# EAGLE design atmega32u4bb (EAGLE 9.5.2)
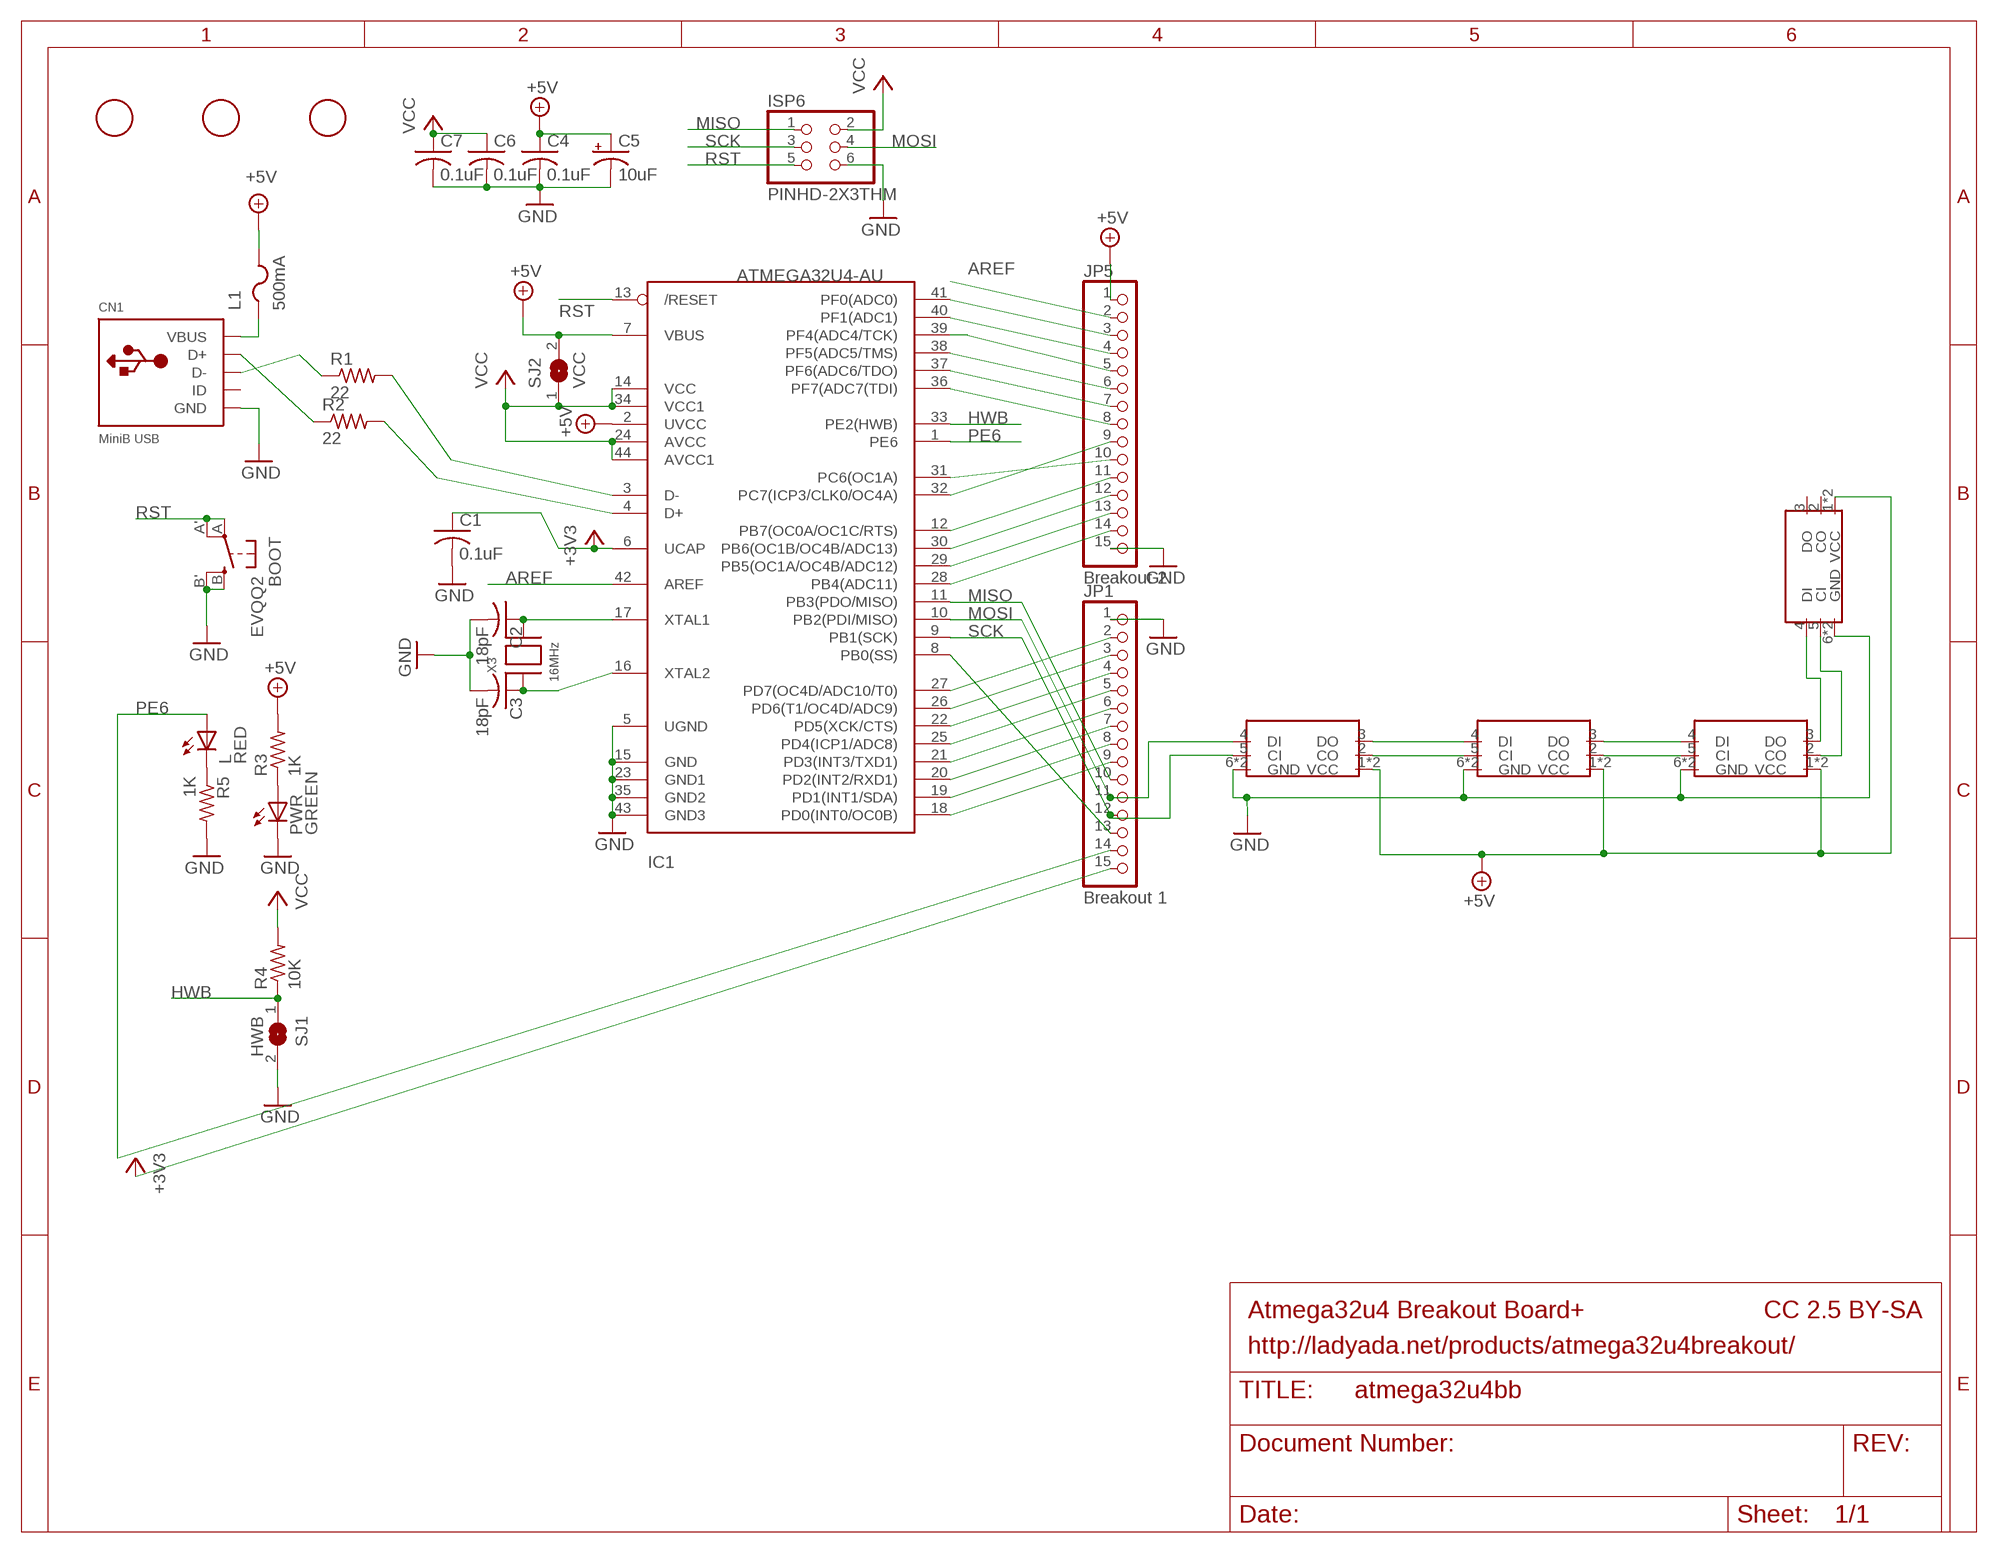
[diagram p0: schematic, sheet 1]

## Parts
BOOT  EVQQ2  [EVQ-Q2]
C1  0.1uF  C-USC0805K  [C0805K]
C2  18pF  C-USC0805K  [C0805K]
C3  18pF  C-USC0805K  [C0805K]
C4  0.1uF  C-USC0805K  [C0805K]
C5  10uF  CPOL-USA/3216-18R  [A/3216-18R]
C6  0.1uF  C-USC0805K  [C0805K]
C7  0.1uF  C-USC0805K  [C0805K]
CN1  MiniB USB  USBMINIB  [USB-MINIB]
IC1  ATMEGA32U4-AU  [TQFP44]
ISP6  PINHD-2X3THM  [ISP6]
JP1  Breakout 1  PINHD-1X15-CB  [1X15-CB]
JP5  Breakout 2  PINHD-1X15-CB  [1X15-CB]
L  RED  LEDCHIPLED_0805  [CHIPLED_0805]
L1  500mA  PTCFUSE-1206  [R1206]
PWR  GREEN  LEDCHIPLED_0805  [CHIPLED_0805]
R1  22  R-US_R0805  [R0805]
R2  22  R-US_R0805  [R0805]
R3  1K  R-US_R0805  [R0805]
R4  10K  R-US_R0805  [R0805]
R5  1K  R-US_R0805  [R0805]
SJ1  HWB  SJ  [SJ]
SJ2  VCC  SJ  [SJ]
U$1  FIDUCIAL  [FIDUCIAL_1MM]
U$2  FIDUCIAL  [FIDUCIAL_1MM]
U$3  DOTSTAR2020  [LED_3341]
U$5  DOTSTAR2020  [LED_3341]
U$6  FIDUCIAL  [FIDUCIAL_1MM]
U$7  DOTSTAR2020  [LED_3341]
U$8  DOTSTAR2020  [LED_3341]
X3  16MHz  XTALNX5032  [NX5032]

## Nets
+3V3: C1.1 IC1.6(UCAP) JP1.15
+5V: C4.1 C5.+ IC1.2(UVCC) IC1.7(VBUS) JP5.1 L1.2 R3.2 SJ2.2 U$3.1(VCC) U$3.8(VCC) U$5.1(VCC) U$5.8(VCC) U$7.1(VCC) U$7.8(VCC) U$8.1(VCC) U$8.8(VCC)
AREF: IC1.42(AREF) JP5.2
GND: BOOT.B'(S1) BOOT.B(S) C1.2 C2.2 C3.2 C4.2 C5.- C6.2 C7.2 CN1.GND IC1.5(UGND) IC1.15(GND) IC1.23(GND1) IC1.35(GND2) IC1.43(GND3) ISP6.6 JP1.1 JP5.15 PWR.C R5.2 SJ1.2 U$3.6(GND) U$3.7(GND) U$5.6(GND) U$5.7(GND) U$7.6(GND) U$7.7(GND) U$8.6(GND) U$8.7(GND)
HWB: IC1.33(PE2(HWB)) R4.1 SJ1.1
MISO: IC1.11(PB3(PDO/MISO)) ISP6.1 JP1.10
MOSI: IC1.10(PB2(PDI/MISO)) ISP6.4 JP1.11 U$3.4(DI)
N$1: PWR.A R3.1
N$2: CN1.D+ R2.1
N$3: IC1.3(D-) R1.2
N$4: IC1.4(D+) R2.2
N$5: CN1.D- R1.1
N$8: C2.1 IC1.17(XTAL1) X3.P$2
N$9: C3.1 IC1.16(XTAL2) X3.P$1
N$10: L.C R5.1
N$11: U$3.3(DO) U$5.4(DI)
N$12: U$3.2(CO) U$5.5(CI)
N$13: U$5.3(DO) U$7.4(DI)
N$14: U$5.2(CO) U$7.5(CI)
N$15: U$7.3(DO) U$8.4(DI)
N$16: U$7.2(CO) U$8.5(CI)
PB0: IC1.8(PB0(SS)) JP1.13
PB4: IC1.28(PB4(ADC11)) JP5.14
PB5: IC1.29(PB5(OC1A/OC4B/ADC12)) JP5.13
PB6: IC1.30(PB6(OC1B/OC4B/ADC13)) JP5.12
PB7: IC1.12(PB7(OC0A/OC1C/RTS)) JP5.11
PC6: IC1.31(PC6(OC1A)) JP5.10
PC7: IC1.32(PC7(ICP3/CLK0/OC4A)) JP5.9
PD0: IC1.18(PD0(INT0/OC0B)) JP1.9
PD1: IC1.19(PD1(INT1/SDA)) JP1.8
PD2: IC1.20(PD2(INT2/RXD1)) JP1.7
PD3: IC1.21(PD3(INT3/TXD1)) JP1.6
PD4: IC1.25(PD4(ICP1/ADC8)) JP1.5
PD5: IC1.22(PD5(XCK/CTS)) JP1.4
PD6: IC1.26(PD6(T1/OC4D/ADC9)) JP1.3
PD7: IC1.27(PD7(OC4D/ADC10/T0)) JP1.2
PE6: IC1.1(PE6) JP1.14 L.A
PF0: IC1.41(PF0(ADC0)) JP5.3
PF1: IC1.40(PF1(ADC1)) JP5.4
PF4: IC1.39(PF4(ADC4/TCK)) JP5.5
PF5: IC1.38(PF5(ADC5/TMS)) JP5.6
PF6: IC1.37(PF6(ADC6/TDO)) JP5.7
PF7: IC1.36(PF7(ADC7(TDI)) JP5.8
RST: BOOT.A'(P1) BOOT.A(P) IC1.13(/RESET) ISP6.5
SCK: IC1.9(PB1(SCK)) ISP6.3 JP1.12 U$3.5(CI)
VBUS: CN1.VBUS L1.1
VCC: C6.1 C7.1 IC1.14(VCC) IC1.24(AVCC) IC1.34(VCC1) IC1.44(AVCC1) ISP6.2 R4.2 SJ2.1
Unconnected: CN1.ID U$8.2(CO) U$8.3(DO)

## Notes on the sheet
- Atmega32u4 Breakout Board+ | CC 2.5 BY-SA
- http://ladyada.net/products/atmega32u4breakout/

## Library data of the parts
BOOT = adaprog:EVQQ2
C1-C4 C6 C7 = adafruit:C-US: CAPACITOR, American symbol
C5 = adafruit:CPOL-US: POLARIZED CAPACITOR, American symbol
CN1 = adafruit:USB: USB Connectors USBMINIB - Surface Mount Female Mini-B USB Connector 4UConnector: 06564 By microbuilder.eu Thru-hole RA Female Mini-B USB Connector 4UConnector: 18732 By ladyada.net
IC1 = adaprog:ATMEGA32U4
ISP6 = adaprog:PINHD-2X3
JP1 JP5 = adafruit:PINHD-1X15: PIN HEADER
L PWR = adafruit:LED: LED OSRAM: - CHIPLED LG R971, LG N971, LY N971, LG Q971, LY Q971, LO R971, LY R971 LH N974, LH R974 LS Q976, LO Q976, LY Q976 LO Q996 - Hyper CHIPLED LW Q18S LB Q993, LB Q99A, LB R99A - SideLED LS A670, LO A670, LY A670, LG A670, LP A670 LB A673, LV A673, LT A673, LW A673 LH A674 LY A675 LS A676, LA A676, LO A676, LY A676, LW A676 LS A679, LY A679, LG A679 - Hyper Micro SIDELED® LS Y876, LA Y876, LO Y876, LY Y876 LT Y87S - SmartLED LW L88C, LW L88S LB L89C, LB L89S, LG L890 LS L89K, LO L89K, LY L89K LS L896, LA L896, LO L896, LY L896 - TOPLED LS T670, LO T670, LY T670, LG T670, LP T670 LSG T670, LSP T670, LSY T670, LOP T670, LYG T670 LG T671, LOG T671, LSG T671 LB T673, LV T673, LT T673, LW T673 LH T674 LS T676, LA T676, LO T676, LY T676, LB T676, LH T676, LSB T676, LW T676 LB T67C, LV T67C, LT T67C, LS T67K, LO T67K, LY T67K, LW E67C LS E67B, LA E67B, LO E67B, LY E67B, LB E67C, LV E67C, LT E67C LW T67C LS T679, LY T679, LG T679 LS T770, LO T770, LY T770, LG T770, LP T770 LB T773, LV T773, LT T773, LW T773 LH T774 LS E675, LA E675, LY E675, LS T675 LS T776, LA T776, LO T776, LY T776, LB T776 LHGB T686 LT T68C, LB T68C - Hyper Mini TOPLED® LB M676 - Mini TOPLED Santana® LG M470 LS M47K, LO M47K, LY M47K Source: http://www.osram.convergy.de/
L1 = adafruit:PTCFUSE: PTC fuses, resettable thermistors
R1-R5 = adafruit:R-US_: RESISTOR, American symbol
SJ1 SJ2 = jumper:SJ: SMD solder JUMPER
U$1 U$2 U$6 = adafruit:FIDUCIAL: For use by pick and place machines to calibrate the vision/machine, 1mm By microbuilder.eu
U$3 U$5 U$7 U$8 = codenext2020:DOTSTAR
X3 = adaprog:XTAL

## Board
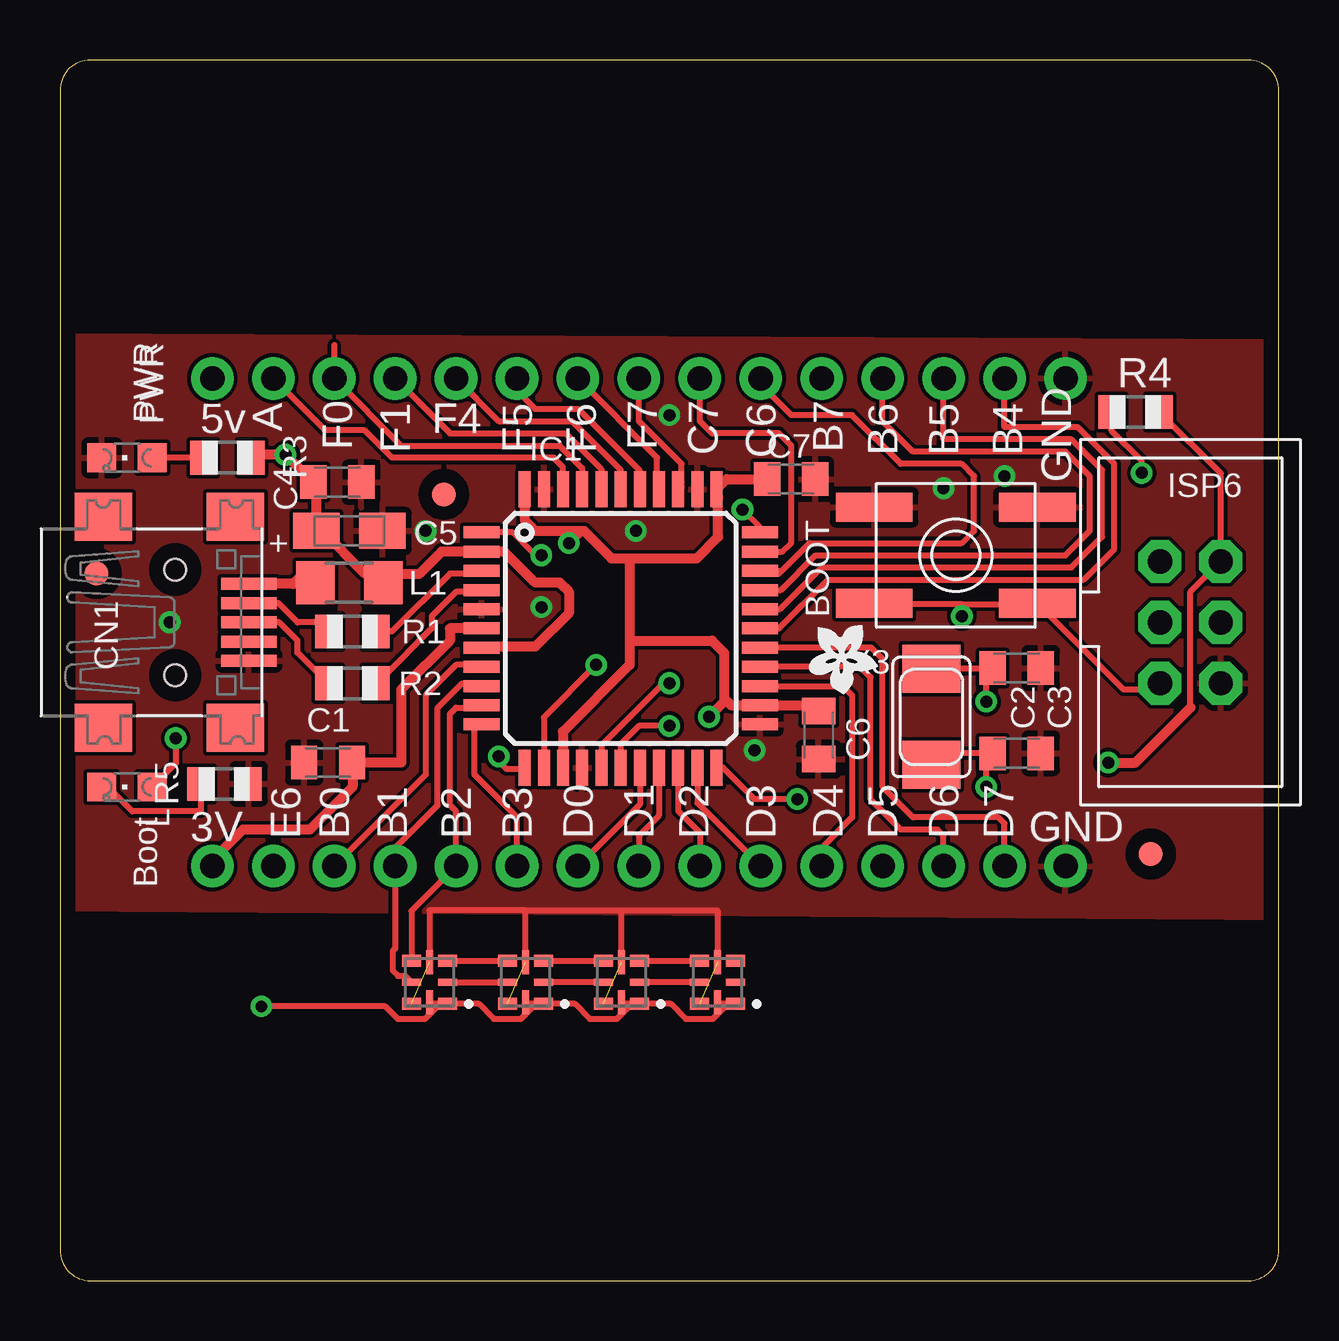
[diagram p1: board, top side]
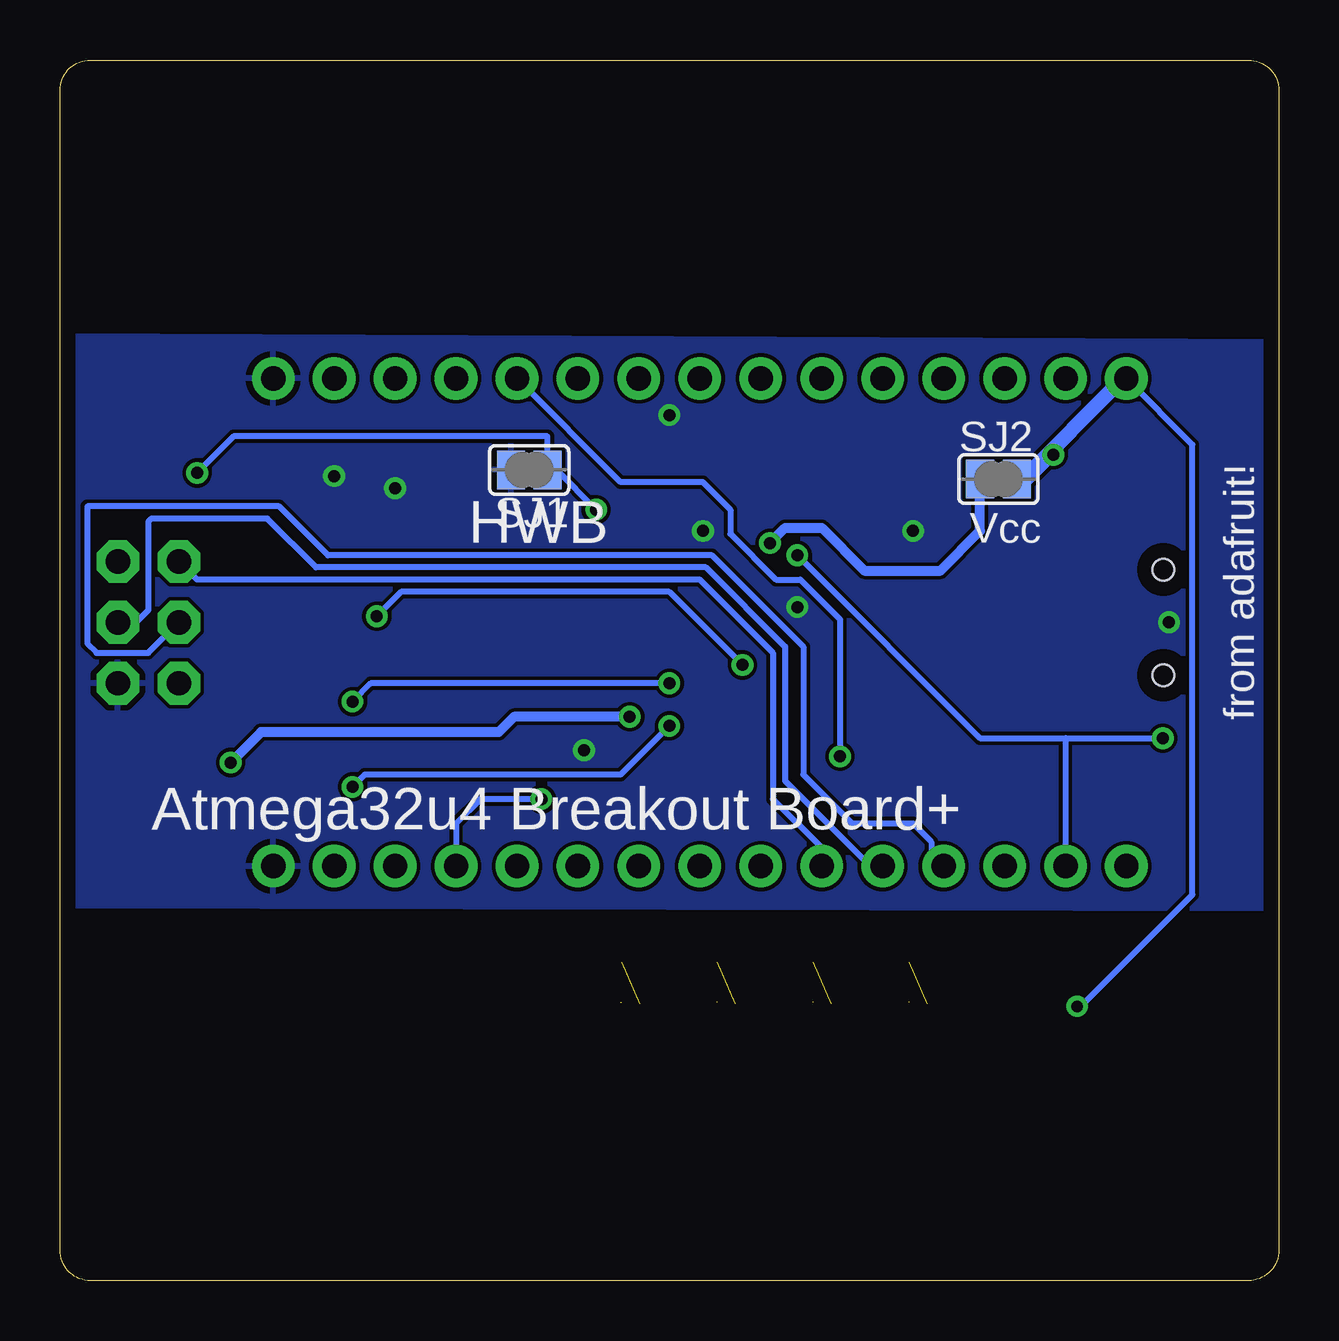
[diagram p2: board, bottom side, seen from below]

Size 50.8 x 50.86 mm. Coordinates in mm from the lower left corner, seen from the top.
Outline: 1.27,50.86 arc90 0,49.59 0,1.27 arc90 1.27,0 49.53,0 arc90 50.8,1.27 50.8,49.59 arc90 49.53,50.86 1.27,50.86
Copper layers (1*16): Top 0.035mm / dielectric 1.5mm / Bottom 0.035mm
Design rules "default *": minimum track width 10mil, minimum drill 19mil, track to track 6mil, track to pad 6mil, pad to pad 6mil, via to via 6mil, smd to smd 0mil, copper to edge 25mil, drill to drill 8mil, minimum pad ring 10mil, minimum via ring 8mil, stop-mask expansion 4mil, vias tented up to drill 20mil, thermal gap 10mil

### Footprints (pad centres in the part's own frame; a part is rotated, then mirrored left to right if it is on the bottom)
EVQ-Q2 = smd 3.2 x 1.2: A -3.4,-2; A' 3.4,-2; B -3.4,2; B' 3.4,2
C0805K = smd 1.1 x 1.4: 1 -1,0; 2 1,0
A/3216-18R = smd 1.95 x 1.5: + 1.375,0; - -1.375,0
USB-MINIB = smd 0.5 x 2.308: D+ 0,4.064; D- -0.8,4.064; GND 1.6,4.064; ID 0.8,4.064; VBUS -1.6,4.064 | smd 2 x 2.4: GND1 -4.4,-2; GND2 -4.4,3.5; GND3 4.4,3.5; GND4 4.4,-2 | hole 0.9: -2.2,1; 2.2,1
TQFP44 = smd 1.5 x 0.5: 1 -5.8,4; 2 -5.8,3.2; 3 -5.8,2.4; 4 -5.8,1.6; 5 -5.8,0.8; 6 -5.8,0; 7 -5.8,-0.8; 8 -5.8,-1.6; 9 -5.8,-2.4; 10 -5.8,-3.2; 11 -5.8,-4; 23 5.8,-4; 24 5.8,-3.2; 25 5.8,-2.4; 26 5.8,-1.6; 27 5.8,-0.8; 28 5.8,0; 29 5.8,0.8; 30 5.8,1.6; 31 5.8,2.4; 32 5.8,3.2; 33 5.8,4 | smd 0.5 x 1.5: 12 -4,-5.8; 13 -3.2,-5.8; 14 -2.4,-5.8; 15 -1.6,-5.8; 16 -0.8,-5.8; 17 0,-5.8; 18 0.8,-5.8; 19 1.6,-5.8; 20 2.4,-5.8; 21 3.2,-5.8; 22 4,-5.8; 34 4,5.8; 35 3.2,5.8; 36 2.4,5.8; 37 1.6,5.8; 38 0.8,5.8; 39 0,5.8; 40 -0.8,5.8; 41 -1.6,5.8; 42 -2.4,5.8; 43 -3.2,5.8; 44 -4,5.8
ISP6 = drill 1.016 pad 1.778 octagon: 1 -2.54,-1.27; 2 -2.54,1.27; 3 0,-1.27; 4 0,1.27; 5 2.54,-1.27; 6 2.54,1.27
1X15-CB = drill 1.016 pad 1.778: 1 -17.78,0; 2 -15.24,0; 3 -12.7,0; 4 -10.16,0; 5 -7.62,0; 6 -5.08,0; 7 -2.54,0; 8 0,0; 9 2.54,0; 10 5.08,0; 11 7.62,0; 12 10.16,0; 13 12.7,0; 14 15.24,0; 15 17.78,0
CHIPLED_0805 = smd 1.2 x 1.2: A 0,-1.05; C 0,1.05
R1206 = smd 1.6 x 1.803: 1 -1.422,0; 2 1.422,0
R0805 = smd 1.1 x 1.4: 1 -1,0; 2 1,0
SJ = smd 1.168 x 1.6: 1 -0.762,0; 2 0.762,0
FIDUCIAL_1MM = smd 1 x 1: 1 0,0
LED_3341 = smd 0.8 x 0.5: 1 -0.75,0.9; 3 -0.75,-0.9; 4 0.75,-0.9; 6 0.75,0.9 | smd 0.8 x 0.3: 2 -0.75,0; 5 0.75,0 | smd 0.3 x 1: 7 0,-0.83; 8 0,0.83
NX5032 = smd 2 x 2.4: P$1 2,0; P$2 -2,0

### Placement (x,y rotation side)
BOOT  37.34,30.22 0 top
C1  11.18,21.59 180 top
C2  39.88,21.97 0 top
C3  39.88,25.52 0 top
C4  11.56,33.27 0 top
C5  12.06,31.24 180 top
C6  31.62,22.73 270 top
C7  30.48,33.4 0 top
CN1  3.81,27.43 270 top
IC1  23.37,27.18 0 top
ISP6  47.12,27.43 270 top
JP1  24.13,17.27 180 top
JP5  24.13,37.59 0 top
L  2.79,20.57 90 top
L1  12.06,29.08 0 top
PWR  2.79,34.29 90 top
R1  12.19,27.05 0 top
R2  12.19,24.89 0 top
R3  6.99,34.29 0 top
R4  44.83,36.19 0 top
R5  6.86,20.7 0 top
SJ1  31.24,33.78 180 bottom
SJ2  11.68,33.4 0 bottom
U$1  45.47,17.78 0 top
U$2  1.52,29.46 0 top
U$3  15.4,12.43 180 top
U$4  [ADAFRUIT200MIL]  32.77,25.91 180 top
U$5  19.4,12.43 180 top
U$6  16,32.76 0 top
U$7  23.4,12.43 180 top
U$8  27.4,12.43 180 top
X3  36.32,23.49 90 top

### Tracks (layer width: path | path; a pad name or v marks a point on that pad's centre or on a via)
+3V3
  Top 0.254: 12.19,21.6 12.19,21.84 | 12.19,21.6 C1.1 12.19,21.59 12.19,21.6
  Top 0.406: IC1.6 16.26,27.18 16.26,26.67 14.22,24.64 14.22,21.59 12.19,21.59 12.19,20.57 10.41,18.79 7.62,18.79 6.35,17.52 JP1.15
  Bottom 0.406: JP1.15 6.22,17.27 6.22,17.14
+5V  (via drill 0.48, 0.5)  (4 unrouted)
  Top 0.254: 10.92,31.24 C5.+ | 13.49,29.44 13.46,29.46 12.7,29.46 | C4.1 10.56,33.13 10.69,33 | 17.53,26.41 IC1.7 | U$7.1 25.46,11.53 26.09,10.9 27.21,10.9 27.84,11.53 U$8.1 27.5,11.53 27.43,11.6 | U$7.1 23.84,11.53 23.21,10.9 22.09,10.9 21.46,11.53 U$5.1 | U$5.1 19.84,11.53 19.21,10.9 18.09,10.9 17.46,11.53 U$3.1 | U$3.1 15.84,11.53 15.21,10.9 14.09,10.9 13.56,11.43 v8.4,11.43 | U$7.1 23.5,11.53 23.43,11.6 | U$5.1 19.5,11.53 19.43,11.6 | U$3.1 15.5,11.53 15.43,11.6
  Top 0.406: 12.7,29.46 10.92,31.24 | L1.2 13.49,29.44 14.96,29.44 15.9,30.38 IC1.2 18.52,30.38 19.81,29.08 20.83,29.08 21.21,28.7 21.21,27.81 19.81,26.41 17.53,26.41 | C5.+ 10.69,33 | 10.56,33.26 10.67,33.15 10.67,33.65 | C4.1 10.56,33.26 | 10.56,33.26 v9.4,34.41 8.13,34.41 8,34.29 R3.2
  Bottom 0.254: JP5.1 3.6,34.84 3.6,16.08 8.25,11.43 v8.4,11.43
  Bottom 0.61: JP5.1 6.48,37.59 10.79,33.27 | SJ2.2 10.92,33.27 10.79,33.27 | v9.4,34.41 9.53,34.41 10.67,33.27 10.79,33.27
AREF
  Top 0.254: IC1.42 20.97,33.89 20.57,34.29 13.84,34.29 12.7,35.43 11.05,35.43 JP5.2
GND  (via drill 0.5)  (4 unrouted)
  Top 0.254: U$3.7 15.4,15.43 19.4,15.43 | U$7.7 23.4,15.43 | U$8.7 27.4,15.43 19.4,15.43 | U$5.7 19.4,15.43
  Bottom 0.406: SJ1.2 30.86,33.78
  other vias: 20.07,28.07 4.57,27.43 15.24,31.24 24,31.24 28.96,22.1 25.4,36.07 36.83,33.02 39.37,33.53
  pour Top: -0.38,15.49 -0.51,39.37 51.18,39.11 51.43,15.11
  pour Bottom: -0.51,39.11 0.13,15.49 50.93,15.62 50.93,39.37
HWB  (via drill 0.5)
  Top 0.254: IC1.33 29.17,31.41 v28.45,32.13 | R4.1 43.83,35.41 45.09,34.16 v45.09,33.65
  Bottom 0.254: v28.45,32.13 30.1,33.78 SJ1.1 30.48,35.18 43.56,35.18 v45.09,33.65
MISO
  Top 0.254: JP1.10 19.05,19.3 17.27,21.08 17.27,23.11 17.53,23.11 17.53,23.13 IC1.11
  Bottom 0.254: ISP6.1 45.09,29.21 24.13,29.21 21.08,26.16 21.08,20.06 19.05,18.03 JP1.10
MOSI
  Top 0.254: 16.51,17.43 JP1.11 14.65,15.41 U$3.4 | 16.51,17.43 16.51,19.56 16.26,19.81 16.26,23.62 16.51,23.87 17.53,23.87 17.53,23.93 IC1.10 | 15.88,16.8 16.51,17.43
  Bottom 0.254: JP1.11 17.02,17.27 20.57,20.83 20.57,26.41 23.88,29.72 40.13,29.72 42.16,31.75 46.99,31.75 47.12,31.62 47.12,27.94 47.62,27.43 ISP6.4
N$1
  Top 0.254: 6.08,34.29 R3.1 PWR.A
N$2
  Top 0.254: CN1.D+ 9.14,27.43 9.91,26.67 9.91,26.16 11.18,24.89 R2.1
N$3
  Top 0.254: R1.2 13.84,27.05 16.26,29.46 17.53,29.46 17.53,29.53 IC1.3
N$4
  Top 0.254: 13.46,25.14 15.49,27.18 15.49,27.68 16.51,28.7 17.53,28.7 17.53,28.73 IC1.4
  Top 0.406: R2.2 13.21,24.89 13.46,25.14
N$5
  Top 0.254: CN1.D- 9.11,28.23 9.91,27.43 10.92,27.43 | 11.43,26.92 11.45,26.94
  Top 0.406: R1.1 11.32,26.92 11.43,26.92 10.92,27.43
N$6
  Bottom 0.406: 11.05,33.4 12.32,33.4
N$8  (via drill 0.5)
  Top 0.254: v25.4,23.11 24.13,23.11 23.37,22.35 IC1.17 | X3.P$2 36.32,21.59 36.7,21.97 C2.1 38.88,21.86 38.61,21.59 v38.61,20.57
  Bottom 0.254: v25.4,23.11 27.43,21.08 38.1,21.08 v38.61,20.57
N$9  (via drill 0.5)
  Top 0.254: v25.4,24.89 25.15,24.89 22.57,22.31 IC1.16 | v38.61,24.13 38.61,25.14 38.88,25.41 C3.1 38.99,25.52 39.02,25.49 | 39.02,25.49 X3.P$1 | 39.02,25.49 39.12,25.4
  Bottom 0.254: v25.4,24.89 37.85,24.89 v38.61,24.13
N$10
  Top 0.254: R5.1 5.86,19.56 3.01,19.56 2,20.57 L.C
N$11
  Top 0.254: U$3.3 U$5.4
N$12
  Top 0.254: U$3.2 U$5.5
N$13
  Top 0.254: U$5.3 U$7.4
N$14
  Top 0.254: U$7.5 U$5.2
N$15
  Top 0.254: U$7.3 U$8.4
N$16
  Top 0.254: U$8.5 U$7.2
PB0
  Top 0.254: JP1.13 15.24,21.08 15.24,24.38 16.51,25.65 17.53,25.65 17.53,25.62 IC1.8
PB4
  Top 0.254: IC1.28 29.97,27.18 32,29.21 42.67,29.21 43.94,30.48 43.94,34.03 42.42,35.56 39.37,35.56 JP5.14
PB5
  Top 0.254: IC1.29 30.01,27.98 31.75,29.72 42.16,29.72 43.43,30.99 43.43,33.78 42.16,35.05 36.83,35.05 JP5.13
PB6
  Top 0.254: IC1.30 30.05,28.78 31.5,30.22 41.91,30.22 42.93,31.24 42.93,33.53 41.91,34.54 35.56,34.54 34.29,35.81 JP5.12
PB7  (via drill 0.5)
  Top 0.254: v18.29,21.84 18.29,21.63 18.58,21.33 19.33,21.33 IC1.12
  Bottom 0.254: JP5.11 27.43,33.27 24,33.27 22.86,32.13 22.86,31.11 20.95,29.21 19.94,29.21 18.29,27.56 v18.29,21.84
PC6
  Top 0.254: 29.97,29.46 29.21,29.46 29.1,29.58 IC1.31 30.09,29.58 31.24,30.73 37.59,30.73 38.1,31.24 38.1,33.53 37.59,34.03 35.05,34.03 33.02,36.07 30.48,36.07 29.21,37.34 JP5.10
PC7
  Top 0.254: IC1.32 30.12,30.38 30.48,30.73 30.48,34.8 29.97,35.3 27.18,35.3 26.67,35.81 JP5.9
PD0
  Top 0.254: IC1.18 24.17,19.85 JP1.9
PD1
  Top 0.254: JP1.8 24.13,18.54 24.97,19.38 IC1.19
PD2
  Top 0.254: IC1.20 25.77,19.57 26.67,18.67 JP1.7
PD3
  Top 0.254: IC1.21 26.57,19.91 JP1.6
PD4
  Top 0.254: IC1.25 32.63,24.78 33.02,24.38 33.02,19.3 31.75,18.03 JP1.5
PD5  (via drill 0.5)
  Top 0.254: IC1.22 27.64,21.38 28.96,20.06 v30.73,20.06
  Bottom 0.254: JP1.4 34.29,19.05 33.27,20.06 v30.73,20.06
PD6
  Top 0.254: IC1.26 33.35,25.58 33.78,25.14 33.78,20.06 35.05,18.79 36.58,18.79 36.83,18.54 JP1.3
PD7
  Top 0.254: IC1.27 33.82,26.38 34.29,25.91 34.29,20.57 35.56,19.3 39.12,19.3 39.37,19.05 JP1.2
PE6  (via drill 0.5)
  Top 0.254: L.A 4.83,21.55 v4.83,22.6 | v20.07,30.22 19.94,30.35 19.68,30.35 18.86,31.18 17.59,31.18 17.57,31.2 | 17.02,31.24 17.5,31.24 IC1.1 17.57,31.2 | 17.57,31.2 17.53,31.24
  Bottom 0.254: 8.89,22.6 12.45,22.6 v20.07,30.22 | 8.89,22.6 v4.83,22.6 | 8.89,22.6 JP1.14
PF0
  Top 0.254: IC1.41 21.77,33.86 20.83,34.8 14.22,34.8 JP5.3 | JP5.3 11.18,37.84 | 11.43,38.98 JP5.3
PF1
  Top 0.254: IC1.40 22.57,33.82 21.08,35.3 16.26,35.3 JP5.4
PF4
  Top 0.254: IC1.39 23.37,33.78 21.34,35.81 18.29,35.81 JP5.5
PF5
  Top 0.254: IC1.38 24.17,33.74 21.59,36.32 19.81,36.32 18.8,37.34 JP5.6
PF6
  Top 0.254: JP5.7 24.89,34.29 24.89,33.02 24.93,33.02 IC1.37
PF7
  Top 0.254: JP5.8 24.13,35.81 25.91,34.03 25.91,33.27 | 25.91,33.12 25.91,33.02 25.81,33.02 IC1.36 25.91,33.12 | 25.91,33.12 25.91,33.27 | 25.91,33.27 25.87,33.23
RST  (via drill 0.5)
  Top 0.254: BOOT.A 33.97,28.19 37.59,28.19 | 37.59,28.19 40.71,28.19 BOOT.A' 44.33,24.64 45.72,24.64 45.72,24.76 ISP6.5 | v37.59,27.68 37.59,28.19 | IC1.13 20.17,23.47 v22.35,25.65
  Bottom 0.254: v22.35,25.65 25.4,28.7 36.58,28.7 v37.59,27.68
SCK
  Top 0.254: JP1.12 13.97,18.03 15.75,19.81 15.75,23.87 16.76,24.89 17.53,24.89 17.53,24.82 IC1.9 | JP1.12 13.23,17.27 | JP1.12 13.97,13.84 13.87,13.74 13.87,12.92 14.09,12.7 14.38,12.7 U$3.5
  Bottom 0.254: JP1.12 14.48,17.78 14.48,18.29 15.24,19.05 17.78,19.05 19.81,21.08 19.81,26.41 23.62,30.22 39.62,30.22 41.66,32.26 49.66,32.26 49.66,26.54 49.28,26.16 47.12,26.16 ISP6.3
VBUS
  Top 0.254: 10.64,29.49 10.41,29.72
  Top 0.406: L1.1 10.64,29.49 | CN1.VBUS 9.73,29.03 10.41,29.72
VCC  (via drill 0.5)
  Top 0.254: R4.2 48.39,33.64 ISP6.2 47.12,28.7 47.12,23.87
  Top 0.406: C7.1 27.79,33.4 IC1.34 27.37,32.7 27.43,32.64 27.43,30.99 26.54,30.1 23.75,30.1 | IC1.44 19.37,31.68 19.81,31.24 21.72,31.24 | 21.72,31.24 21.84,31.24 22.99,30.1 23.75,30.1 | IC1.14 20.97,22.87 23.75,25.65 23.75,26.67 | 23.75,30.1 23.75,26.67 | 27.69,24.25 27.96,23.98 IC1.24 31.27,23.98 31.62,23.62 C6.1 | 27.69,24.25 27.69,26.16 27.18,26.67 23.75,26.67 | v27.05,23.49 27.69,24.13 27.69,24.25 | 21.72,31.24 v21.21,30.73 | 47.12,23.87 44.83,21.59 v43.69,21.59
  Bottom 0.406: v43.69,21.59 42.42,22.86 32.51,22.86 31.88,23.49 v27.05,23.49 | SJ2.1 12.45,31.24 14.1,29.59 17.27,29.59 19.05,31.37 20.57,31.37 v21.21,30.73

### Text on the board
tPlace: 5v | A | F0 | F1 | F5 | F6 | F7 | C7 | C6 | B7 | B6 | B5 | B4 | PWR | F4 | GND | 3V | E6 | B0 | B1 | B2 | B3 | D0 | D1 | D2 | D3 | D4 | D5 | D6 | D7 | GND | Boot
bPlace: from adafruit! | Vcc | HWB | Atmega32u4 Breakout Board+